# EAGLE board OpenDeck-r2.0.1 (EAGLE 7.4.0)
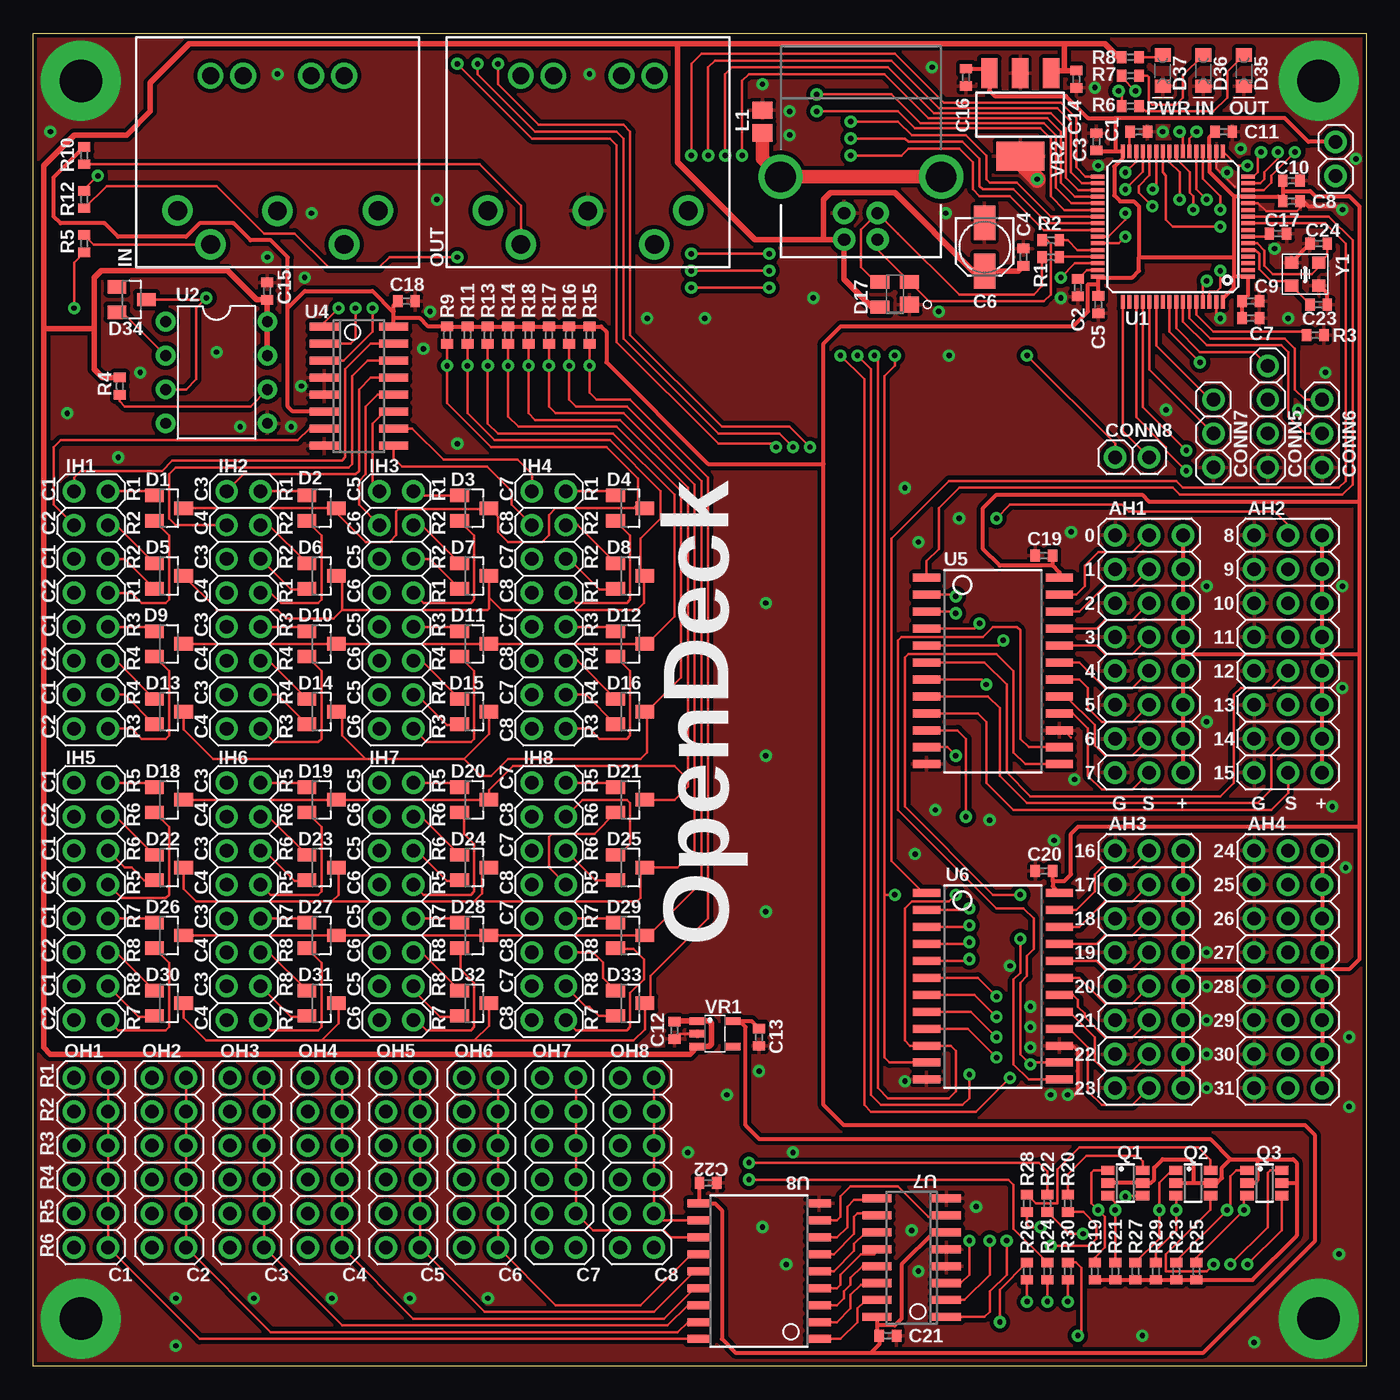
[diagram p5: board, top side]
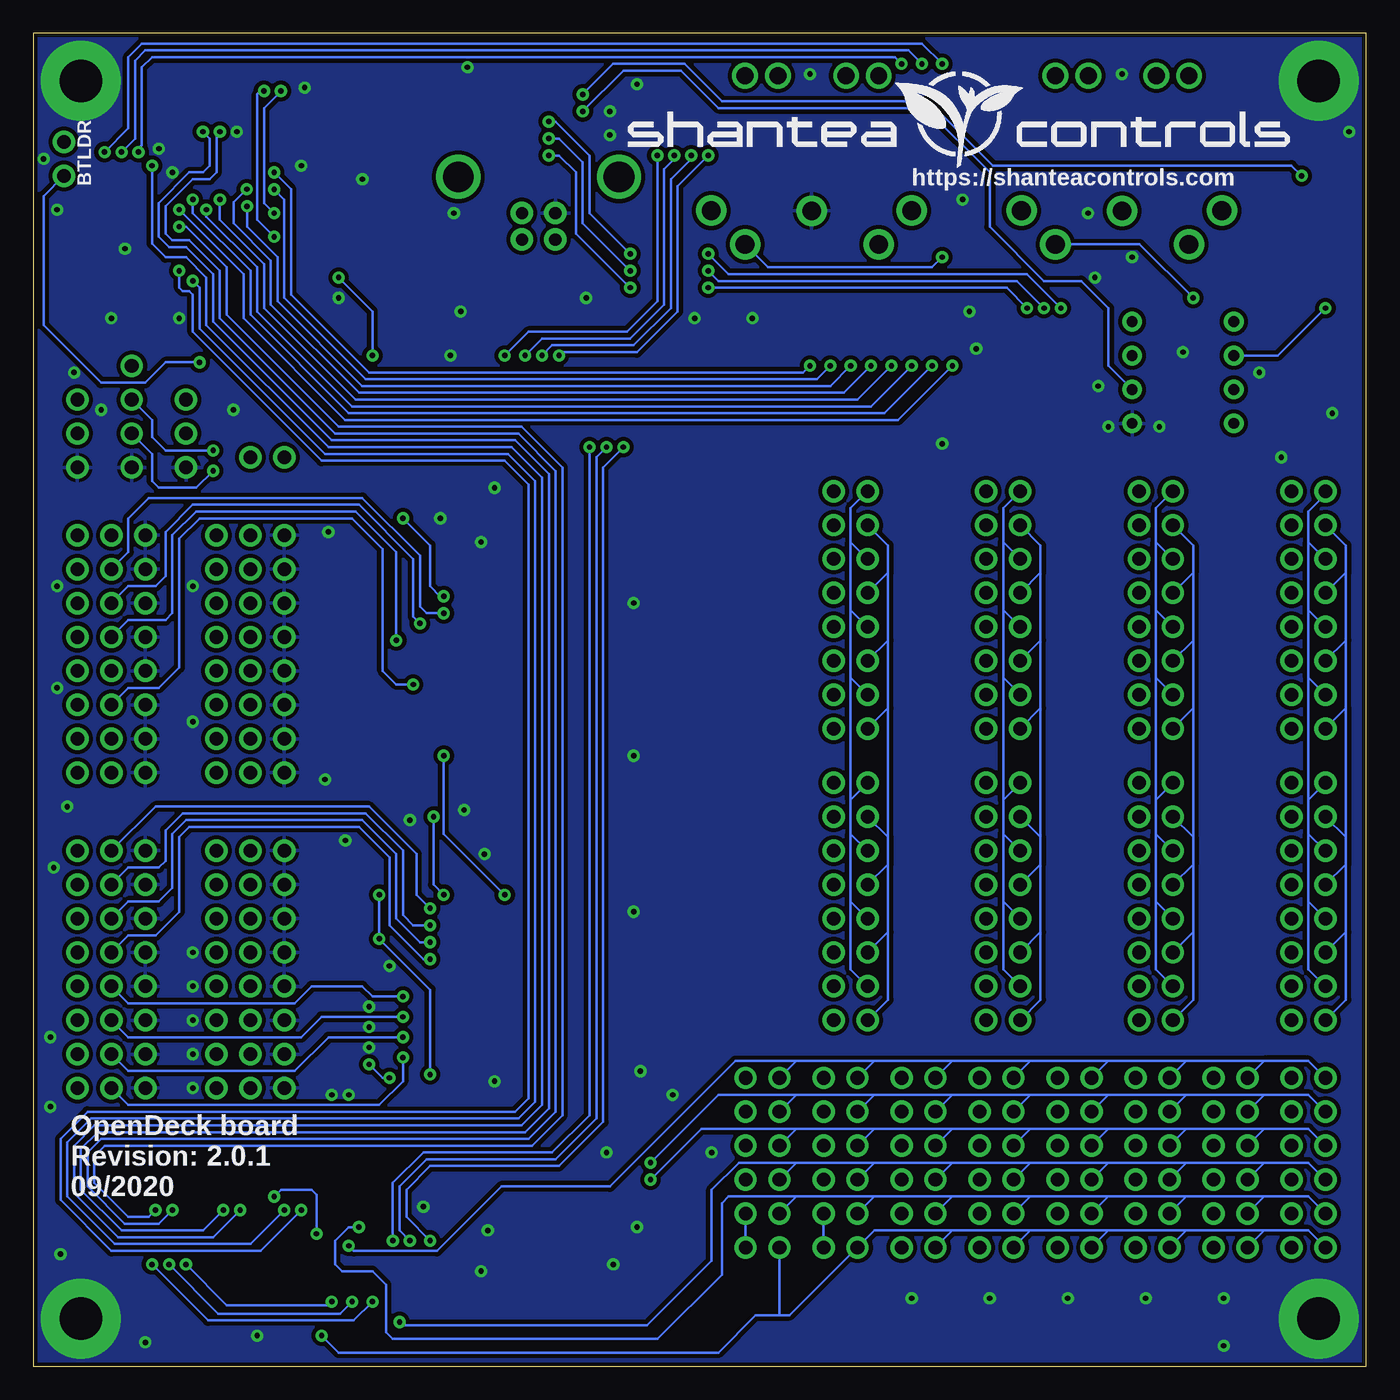
[diagram p6: board, bottom side, seen from below]

Size 99.82 x 99.82 mm. Coordinates in mm from the lower left corner, seen from the top.
Outline: 0,99.82 99.82,99.82 99.82,0 0,0 0,99.82
Copper layers (1*16): Top 0.035mm / dielectric 1.5mm / Bottom 0.035mm
Design rules "smiery *": minimum track width 8mil, minimum drill 12mil, track to track 7mil, track to pad 5mil, pad to pad 5mil, via to via 6mil, smd to smd 0mil, copper to edge 12mil, drill to drill 10mil, minimum pad ring 13mil, minimum via ring 10mil, stop-mask expansion 2mil, vias tented up to drill 25mil, thermal gap 10mil
Net classes: 0 default: width 0.203 mm; 1 vcc: width 0.254 mm

## Footprints (pad centres in the part's own frame; a part is rotated, then mirrored left to right if it is on the bottom)
3X08-2.54 = drill 1.016: 1 -8.89,-2.54; 2 -8.89,0; 3 -8.89,2.54; 4 -6.35,-2.54; 5 -6.35,0; 6 -6.35,2.54; 7 -3.81,-2.54; 8 -3.81,0; 9 -3.81,2.54; 10 -1.27,-2.54; 11 -1.27,0; 12 -1.27,2.54; 13 1.27,-2.54; 14 1.27,0; 15 1.27,2.54; 16 3.81,-2.54; 17 3.81,0; 18 3.81,2.54; 19 6.35,-2.54; 20 6.35,0; 21 6.35,2.54; 22 8.89,-2.54; 23 8.89,0; 24 8.89,2.54
C0402 = smd 0.7 x 0.9: 1 -0.65,0; 2 0.65,0
153CLV-0405 = smd 2.6 x 1.6: + 1.8,0; - -1.8,0
USB-B-PTH = drill 0.914 pad 1.676: D+ 1.25,-4.572; D- 1.25,-6.553; GND -1.25,-4.572; VBUS -1.25,-6.553 | drill 2.286: S1 -6.02,-1.854; S2 6.02,-1.854
1X02-2.54-V = drill 1.016: 1 -1.27,0; 2 1.27,0
DIN5_SUPPORT = drill 1.4 pad 2.286: 1 -7.483,-4.768; 2 -0.003,-4.778; 3 7.527,-4.768; 4 -5.013,-7.298; 5 4.987,-7.288 | drill 1.27: 6 4.987,5.341; 7 -5.02,5.341; 8 -2.582,5.341; 9 2.523,5.341
1X04-2.54 = drill 1.016: 1 -3.81,0; 2 -1.27,0; 3 1.27,0; 4 3.81,0
1X03-2.54-V = drill 1.016: 1 -2.54,0; 2 0,0; 3 2.54,0
SOT23 = smd 1.4 x 1: 1 -1.1,0.95; 2 -1.1,-0.95; 3 1.1,0
SOT143 = smd 1.44 x 1.2: 1 -1.1,0.75 | smd 1.44 x 1: 2 -1.1,-0.95; 3 1.1,-0.95; 4 1.1,0.95
0805_LED = smd 0.978 x 1.2: A -1.175,0; C 1.18,0
2X08-2.54 = drill 1.016: 1 -8.89,-1.27; 2 -8.89,1.27; 3 -6.35,-1.27; 4 -6.35,1.27; 5 -3.81,-1.27; 6 -3.81,1.27; 7 -1.27,-1.27; 8 -1.27,1.27; 9 1.27,-1.27; 10 1.27,1.27; 11 3.81,-1.27; 12 3.81,1.27; 13 6.35,-1.27; 14 6.35,1.27; 15 8.89,-1.27; 16 8.89,1.27
L0805 = smd 1.3 x 1.5: 1 -0.85,0; 2 0.85,0
2X06-2.54-V = drill 1.016: 1 -6.35,-1.27; 2 -6.35,1.27; 3 -3.81,-1.27; 4 -3.81,1.27; 5 -1.27,-1.27; 6 -1.27,1.27; 7 1.27,-1.27; 8 1.27,1.27; 9 3.81,-1.27; 10 3.81,1.27; 11 6.35,-1.27; 12 6.35,1.27
SSOT6 = smd 0.99 x 0.69: 1 -1.3,0.95; 2 -1.3,0; 3 -1.3,-0.95; 4 1.3,-0.95; 5 1.3,0; 6 1.3,0.95
R0402 = smd 0.7 x 0.9: 1 -0.65,0; 2 0.65,0
TQFP-64-10X10 = smd 1 x 0.3: 1 -5.625,3.75; 2 -5.625,3.25; 3 -5.625,2.75; 4 -5.625,2.25; 5 -5.625,1.75; 6 -5.625,1.25; 7 -5.625,0.75; 8 -5.625,0.25; 9 -5.625,-0.25; 10 -5.625,-0.75; 11 -5.625,-1.25; 12 -5.625,-1.75; 13 -5.625,-2.25; 14 -5.625,-2.75; 15 -5.625,-3.25; 16 -5.625,-3.75; 33 5.625,-3.75; 34 5.625,-3.25; 35 5.625,-2.75; 36 5.625,-2.25; 37 5.625,-1.75; 38 5.625,-1.25; 39 5.625,-0.75; 40 5.625,-0.25; 41 5.625,0.25; 42 5.625,0.75; 43 5.625,1.25; 44 5.625,1.75; 45 5.625,2.25; 46 5.625,2.75; 47 5.625,3.25; 48 5.625,3.75 | smd 0.3 x 1: 17 -3.75,-5.625; 18 -3.25,-5.625; 19 -2.75,-5.625; 20 -2.25,-5.625; 21 -1.75,-5.625; 22 -1.25,-5.625; 23 -0.75,-5.625; 24 -0.25,-5.625; 25 0.25,-5.625; 26 0.75,-5.625; 27 1.25,-5.625; 28 1.75,-5.625; 29 2.25,-5.625; 30 2.75,-5.625; 31 3.25,-5.625; 32 3.75,-5.625; 49 3.75,5.625; 50 3.25,5.625; 51 2.75,5.625; 52 2.25,5.625; 53 1.75,5.625; 54 1.25,5.625; 55 0.75,5.625; 56 0.25,5.625; 57 -0.25,5.625; 58 -0.75,5.625; 59 -1.25,5.625; 60 -1.75,5.625; 61 -2.25,5.625; 62 -2.75,5.625; 63 -3.25,5.625; 64 -3.75,5.625
DIL08 = drill 0.813: 1 -3.81,3.81; 2 -3.81,1.27; 3 -3.81,-1.27; 4 -3.81,-3.81; 5 3.81,-3.81; 6 3.81,-1.27; 7 3.81,1.27; 8 3.81,3.81
SO16 = smd 2.2 x 0.6: 1 -2.6,4.445; 2 -2.6,3.175; 3 -2.6,1.905; 4 -2.6,0.635; 5 -2.6,-0.635; 6 -2.6,-1.905; 7 -2.6,-3.175; 8 -2.6,-4.445; 9 2.6,-4.445; 10 2.6,-3.175; 11 2.6,-1.905; 12 2.6,-0.635; 13 2.6,0.635; 14 2.6,1.905; 15 2.6,3.175; 16 2.6,4.445
SO24-W = smd 2.032 x 0.6: 1 -4.975,6.985; 2 -4.975,5.715; 3 -4.975,4.445; 4 -4.975,3.175; 5 -4.975,1.905; 6 -4.975,0.635; 7 -4.975,-0.635; 8 -4.975,-1.905; 9 -4.975,-3.175; 10 -4.975,-4.445; 11 -4.975,-5.715; 12 -4.975,-6.985; 13 4.975,-6.985; 14 4.975,-5.715; 15 4.975,-4.445; 16 4.975,-3.175; 17 4.975,-1.905; 18 4.975,-0.635; 19 4.975,0.635; 20 4.975,1.905; 21 4.975,3.175; 22 4.975,4.445; 23 4.975,5.715; 24 4.975,6.985
SO18 = smd 1.8 x 0.6: 1 -4.475,5.08; 2 -4.475,3.81; 3 -4.475,2.54; 4 -4.475,1.27; 5 -4.475,0; 6 -4.475,-1.27; 7 -4.475,-2.54; 8 -4.475,-3.81; 9 -4.475,-5.08; 10 4.475,-5.08; 11 4.475,-3.81; 12 4.475,-2.54; 13 4.475,-1.27; 14 4.475,0; 15 4.475,1.27; 16 4.475,2.54; 17 4.475,3.81; 18 4.475,5.08
SOT23-5 = smd 1.2 x 0.55: 1 1.3,-0.95; 2 1.3,0; 3 1.3,0.95; 4 -1.3,0.95; 5 -1.3,-0.95
SOT223 = smd 2.235 x 1.219: 1 -3.099,2.311; 2 -3.099,0; 3 -3.099,-2.311 | smd 2.2 x 3.6: 4 3.099,0
CRYSTAL-SMD-2.5X2 = smd 1 x 0.9: 1 -1.025,-0.875; 2 1.025,-0.875; 3 1.025,0.875; 4 -1.025,0.875

## Placement (x,y rotation side)
AH1  PINHD-3X08  [3X08-2.54]  83.57,53.34 270 top
AH2  PINHD-3X08  [3X08-2.54]  93.98,53.34 270 top
AH3  PINHD-3X08  [3X08-2.54]  83.57,29.72 270 top
AH4  PINHD-3X08  [3X08-2.54]  93.98,29.72 270 top
C1  2.2u  [C0402]  82.8,92.46 180 top
C2  2.2u  [C0402]  78.23,80.77 270 top
C3  100n  [C0402]  79.63,91.69 90 top
C4  100n  [C0402]  74.17,83.06 270 top
C5  100n  [C0402]  79.76,79.5 270 top
C6  10u  [153CLV-0405]  71.25,83.82 270 top
C7  100n  [C0402]  91.19,78.49 0 top
C8  100n  [C0402]  94.23,87.25 0 top
C9  100n  [C0402]  91.19,79.76 0 top
C10  100n  [C0402]  94.23,88.77 0 top
C11  100n  [C0402]  89.15,92.46 0 top
C12  4.7u  [C0402]  48.01,25.15 270 top
C13  4.7u  [C0402]  54.36,24.64 270 top
C14  4.7u  [C0402]  78.11,96.39 270 top
C15  100n  [C0402]  17.53,80.52 270 top
C16  4.7u  [C0402]  69.85,96.52 270 top
C17  100n  [C0402]  93.22,84.84 0 top
C18  100n  [C0402]  27.94,79.76 180 top
C19  100n  [C0402]  75.69,60.71 0 top
C20  100n  [C0402]  75.69,37.08 0 top
C21  100n  [C0402]  64.01,2.29 0 top
C22  100n  [C0402]  50.55,13.72 0 top
C23  18p  [C0402]  96.27,79.5 0 top
C24  18p  [C0402]  96.27,84.07 180 top
CONN1  USB-H  [USB-B-PTH]  61.98,90.93 0 top
CONN2  PINHD-1X02-TH-2.54MM  [1X02-2.54-V]  97.54,90.42 90 top
CONN3  MIDI_CONN-STD  [DIN5_SUPPORT]  18.29,91.31 0 top
CONN4  MIDI_CONN-STD  [DIN5_SUPPORT]  41.53,91.31 0 top
CONN5  PINHD-1X04-TH-2.54MM  [1X04-2.54]  92.46,71.12 270 top
CONN6  PINHD-1X03-TH-2.54MM  [1X03-2.54-V]  96.52,69.85 270 top
CONN7  PINHD-1X03-TH-2.54MM  [1X03-2.54-V]  88.39,69.85 270 top
CONN8  PINHD-1X02-TH-2.54MM  [1X02-2.54-V]  82.3,68.07 0 top
D1  BAW56  [SOT23]  10.16,64.26 0 top
D2  BAW56  [SOT23]  21.59,64.26 0 top
D3  BAW56  [SOT23]  33.02,64.26 0 top
D4  BAW56  [SOT23]  44.7,64.26 0 top
D5  BAW56  [SOT23]  10.16,59.18 0 top
D6  BAW56  [SOT23]  21.59,59.18 0 top
D7  BAW56  [SOT23]  33.02,59.18 0 top
D8  BAW56  [SOT23]  44.7,59.18 0 top
D9  BAW56  [SOT23]  10.16,54.1 0 top
D10  BAW56  [SOT23]  21.59,54.1 0 top
D11  BAW56  [SOT23]  33.02,54.1 0 top
D12  BAW56  [SOT23]  44.7,54.1 0 top
D13  BAW56  [SOT23]  10.16,49.02 0 top
D14  BAW56  [SOT23]  21.59,49.02 0 top
D15  BAW56  [SOT23]  33.02,49.02 0 top
D16  BAW56  [SOT23]  44.7,49.02 0 top
D17  PRTR5V0U2X  [SOT143]  64.52,80.26 180 top
D18  BAW56  [SOT23]  10.16,42.42 0 top
D19  BAW56  [SOT23]  21.59,42.42 0 top
D20  BAW56  [SOT23]  33.02,42.42 0 top
D21  BAW56  [SOT23]  44.7,42.42 0 top
D22  BAW56  [SOT23]  10.16,37.34 0 top
D23  BAW56  [SOT23]  21.59,37.34 0 top
D24  BAW56  [SOT23]  33.02,37.34 0 top
D25  BAW56  [SOT23]  44.7,37.34 0 top
D26  BAW56  [SOT23]  10.16,32.26 0 top
D27  BAW56  [SOT23]  21.59,32.26 0 top
D28  BAW56  [SOT23]  33.02,32.26 0 top
D29  BAW56  [SOT23]  44.7,32.26 0 top
D30  BAW56  [SOT23]  10.16,27.18 0 top
D31  BAW56  [SOT23]  21.59,27.18 0 top
D32  BAW56  [SOT23]  33.02,27.18 0 top
D33  BAW56  [SOT23]  44.7,27.18 0 top
D34  BAW56  [SOT23]  7.37,79.88 0 top
D35  Red  [0805_LED]  90.68,97.03 270 top
D36  Yellow  [0805_LED]  87.63,97.03 270 top
D37  Green  [0805_LED]  84.58,97.03 270 top
IH1  PINHD-2X08-TH-2.54MM  [2X08-2.54]  4.32,56.64 270 top
IH2  PINHD-2X08-TH-2.54MM  [2X08-2.54]  15.75,56.64 270 top
IH3  PINHD-2X08-TH-2.54MM  [2X08-2.54]  27.18,56.64 270 top
IH4  PINHD-2X08-TH-2.54MM  [2X08-2.54]  38.61,56.64 270 top
IH5  PINHD-2X08-TH-2.54MM  [2X08-2.54]  4.32,34.8 270 top
IH6  PINHD-2X08-TH-2.54MM  [2X08-2.54]  15.75,34.8 270 top
IH7  PINHD-2X08-TH-2.54MM  [2X08-2.54]  27.18,34.8 270 top
IH8  PINHD-2X08-TH-2.54MM  [2X08-2.54]  38.61,34.8 270 top
L1  FERRITE_BEAD-BLM21PG221SN1D  [L0805]  54.61,93.22 270 top
OH1  PINHD-2X06-TH-2.54MM  [2X06-2.54-V]  4.32,15.24 270 top
OH2  PINHD-2X06-TH-2.54MM  [2X06-2.54-V]  10.16,15.24 270 top
OH3  PINHD-2X06-TH-2.54MM  [2X06-2.54-V]  16,15.24 270 top
OH4  PINHD-2X06-TH-2.54MM  [2X06-2.54-V]  21.84,15.24 270 top
OH5  PINHD-2X06-TH-2.54MM  [2X06-2.54-V]  27.69,15.24 270 top
OH6  PINHD-2X06-TH-2.54MM  [2X06-2.54-V]  33.53,15.24 270 top
OH7  PINHD-2X06-TH-2.54MM  [2X06-2.54-V]  39.37,15.24 270 top
OH8  PINHD-2X06-TH-2.54MM  [2X06-2.54-V]  45.21,15.24 270 top
Q1  FDC6312P  [SSOT6]  81.79,13.72 0 top
Q2  FDC6312P  [SSOT6]  86.87,13.72 0 top
Q3  FDC6312P  [SSOT6]  92.2,13.72 0 top
R1  22  [R0402]  76.2,83.06 0 top
R2  22  [R0402]  76.2,84.33 180 top
R3  510  [R0402]  96.01,77.22 180 top
R4  10k  [R0402]  6.48,73.41 270 top
R5  220  [R0402]  3.81,84.07 270 top
R6  1k  [R0402]  82.17,94.36 180 top
R7  1k  [R0402]  82.17,96.65 180 top
R8  1k  [R0402]  82.17,98.04 0 top
R9  4.7k  [R0402]  30.99,77.22 270 top
R10  33  [R0402]  3.81,90.68 90 top
R11  4.7k  [R0402]  32.51,77.22 270 top
R12  10  [R0402]  3.81,87.38 90 top
R13  4.7k  [R0402]  34.04,77.22 270 top
R14  4.7k  [R0402]  35.56,77.22 270 top
R15  4.7k  [R0402]  41.66,77.22 270 top
R16  4.7k  [R0402]  40.13,77.22 270 top
R17  4.7k  [R0402]  38.61,77.22 270 top
R18  4.7k  [R0402]  37.08,77.22 270 top
R19  4.7k  [R0402]  79.5,7.11 90 top
R20  36  [R0402]  77.47,12.19 90 top
R21  4.7k  [R0402]  81.03,7.11 90 top
R22  36  [R0402]  75.95,12.19 90 top
R23  4.7k  [R0402]  85.6,7.11 90 top
R24  36  [R0402]  75.95,7.11 270 top
R25  4.7k  [R0402]  87.12,7.11 90 top
R26  36  [R0402]  74.42,7.11 270 top
R27  4.7k  [R0402]  82.55,7.11 90 top
R28  36  [R0402]  74.42,12.19 90 top
R29  4.7k  [R0402]  84.07,7.11 90 top
R30  36  [R0402]  77.47,7.11 270 top
U1  STM32F405RGT6  [TQFP-64-10X10]  85.34,85.34 180 top
U2  6N137  [DIL08]  13.72,74.42 0 top
U4  74HC138-SO  [SO16]  24.38,73.41 0 top
U5  MC14067BDWR2G-SO24W  [SO24-W]  71.88,52.07 0 top
U6  MC14067BDWR2G-SO24W  [SO24-W]  71.88,28.45 0 top
U7  74HC238-SO  [SO16]  65.79,8.13 180 top
U8  ULN2803A-SO  [SO18]  54.36,7.11 180 top
VR1  LP5907-4.5V  [SOT23-5]  51.05,24.89 180 top
VR2  MCP1825  [SOT223]  73.91,93.73 270 top
Y1  16MHz  [CRYSTAL-SMD-2.5X2]  95.25,81.79 0 top

## Tracks (layer width: path | path; a pad name or v marks a point on that pad's centre or on a via)
+3V3
  Top 0.305: 81.03,90.97 U1.32 81.59,90.48 80.96,89.85 80.96,87.69 81.41,87.25 82.42,87.25 82.8,86.87 82.8,83.06 | 81.03,90.97 79.7,90.97 C3.1 | 79.72,81.03 U1.48 79.78,81.53 82.3,81.53 82.8,82.04 82.8,83.06 | 79.72,81.03 79.72,80.19 C5.1 | C11.1 88.09,92.05 U1.19 88.09,89.45 89.92,87.63 | C10.1 93.58,88.01 | 93.58,88.01 C8.1 93.24,87.59 U1.13 89.95,87.59 89.92,87.63 | 89.92,87.63 89.92,83.06 | 89.92,83.06 89.92,81.53 | 89.92,81.53 89.98,81.59 U1.1 90.97,80.19 C9.1 C7.1 | C16.1 71.26,97.17 VR2.3 71.6,95.53 72.01,95.12 77.34,95.12 78.99,93.47 81.03,93.47 | 81.03,93.47 81.03,90.97 | U4.16 26.98,78.49 | 26.98,78.49 26.98,78.99 | 26.98,78.99 26.98,79.45 C18.2 | 26.98,78.49 28.96,78.49 29.58,77.87 R9.1 R11.1 R13.1 R14.1 R18.1 R17.1 R16.1 R15.1 42.53,77.87 42.93,77.47 42.93,75.18 50.55,67.56 59.18,67.56 | U4.6 19.43,71.5 19.05,71.88 19.05,79.25 | 19.05,79.25 20.32,80.52 25.4,80.52 26.92,78.99 26.98,78.99 | 79.72,81.03 78.99,81.03 78.99,78.99 77.87,77.87 60.45,77.87 59.18,76.6 59.18,67.56 | U7.16 63.19,3.05 | 63.19,3.05 63.19,2.46 C21.1 63.36,1.64 62.74,1.02 | U7.6 67.44,10.03 65.02,7.62 65.02,3.56 64.52,3.05 63.19,3.05 | 62.74,1.02 52.58,1.02 51.56,2.03 51.56,11.68 51.05,12.19 U8.10 49.88,13.7 C22.1 | 76.36,59.94 76.36,60.69 C19.2 | 76.36,36.32 76.36,37.07 C20.2 | 76.36,59.94 72.39,59.94 71.12,61.21 71.12,64.26 72.14,65.28 83.06,65.28 83.57,64.77 99.31,64.77 | 76.36,36.32 77.22,36.32 77.72,36.83 77.72,39.88 78.23,40.39 99.31,40.39 | 62.74,1.02 87.63,1.02 96.01,9.4 96.01,17.27 95.25,18.03 60.71,18.03 59.18,19.56 59.18,67.56 | 81.03,93.47 93.73,93.47 95.5,91.69 CONN2.2 | 82.8,83.06 89.92,83.06
  Top 0.305: U1.64 89.09,79.95 89.92,80.77 89.92,81.53 | 93.58,88.01 95.63,88.01 96.01,87.63 98.55,87.63 99.31,86.87 99.31,64.77 | AH1.3 AH1.6 AH1.9 AH1.12 86.11,53.34 | 86.11,53.34 AH1.15 AH1.18 AH1.21 AH1.24 | AH2.24 AH2.21 AH2.18 AH2.15 96.52,53.34 | AH2.3 AH2.6 AH2.9 AH2.12 96.52,53.34 | 99.31,64.77 99.31,53.34 | AH3.3 AH3.6 AH3.9 AH3.12 86.11,29.72 | AH3.24 AH3.21 AH3.18 AH3.15 86.11,29.72 | AH4.3 AH4.6 AH4.9 AH4.12 96.52,29.72 | 96.52,29.72 AH4.15 AH4.18 AH4.21 AH4.24 | 86.11,53.34 96.52,53.34 | 96.52,53.34 99.31,53.34 | 99.31,53.34 99.31,40.39 | 99.31,40.39 99.31,30.48 98.55,29.72 96.52,29.72 | 86.11,29.72 96.52,29.72 | 19.05,79.25 19.05,83.06 17.78,84.33 16.26,84.33 14.99,85.6 12.45,85.6 11.43,84.58 6.35,84.58 5.33,85.6 2.03,85.6 1.52,86.11 1.52,89.04 R10.2 | U5.24 76.86,59.44 76.36,59.94 | 76.36,36.32 76.36,35.93 U6.24
+5V
  Top 0.406: R8.1 81.28,98.04 80.26,99.06 77.22,99.06 | 77.22,99.06 48.26,99.06 | 4.57,77.72 4.57,74.68 5.19,74.06 R4.1 | 4.57,77.72 4.57,81.53 5.08,82.04 14.57,82.04 16.74,79.87 C15.2 U2.8 U2.7 | 4.57,77.72 0.76,77.72 | D17.4 62.81,79.31 60.73,81.4 CONN1.VBUS 59.18,84.38 | C14.1 77.22,97.04 | 77.22,97.04 76.44,97.04 VR2.1 | 77.22,97.04 77.22,99.06 | C4.2 73.78,82.02 C6.+ 70.38,82.02 64.52,87.88 59.69,87.88 59.18,87.38 59.18,84.38 | 48.26,99.06 48.26,90.17 54.05,84.38 59.18,84.38 | 48.26,99.06 11.68,99.06 8.76,96.14 8.76,93.98 6.99,92.2 3.05,92.2 0.76,89.92 0.76,77.72 | VR1.3 50.61,23.94 50.8,24.13 50.8,25.65 50.61,25.84 VR1.1 48.05,25.84 C12.1 | 0.76,77.72 0.76,23.88 1.27,23.37 49.18,23.37 VR1.3 | 49.78,23.91 VR1.3
A_IN_0
  Top 0.203: U5.23 78.11,57.78 78.74,58.42 78.74,59.94 79.76,60.96 82.3,60.96 AH1.2
A_IN_1
  Top 0.203: U5.22 78.36,56.52 80.26,58.42 82.3,58.42 AH1.5
A_IN_2
  Top 0.203: U5.21 79.63,55.24 80.26,55.88 82.3,55.88 AH1.8
A_IN_3
  Top 0.203: U5.20 79.63,53.98 80.26,53.34 82.3,53.34 AH1.11
A_IN_4
  Top 0.203: U5.19 78.36,52.7 80.26,50.8 82.3,50.8 AH1.14
A_IN_5
  Top 0.203: U5.18 78.36,51.44 78.99,50.8 78.99,49.28 80.01,48.26 82.3,48.26 AH1.17
A_IN_6
  Top 0.203: U5.17 77.34,50.16 79.5,48.01 79.5,46.48 80.26,45.72 82.3,45.72 AH1.20
A_IN_7
  Top 0.203: U5.16 77.85,48.9 78.99,47.75 78.99,44.2 80.01,43.18 82.3,43.18 AH1.23
A_IN_8  (via drill 0.4 pad 0.6)
  Top 0.203: v72.14,63.5 73.15,64.52 81.53,64.52 82.04,64.01 92.96,64.01 93.98,62.99 AH2.2 | U5.2 68.96,57.78 v69.09,57.66
  Bottom 0.203: v72.14,63.5 70.1,61.47 70.1,58.42 69.34,57.66 v69.09,57.66
A_IN_9  (via drill 0.4 pad 0.6)
  Top 0.203: U5.3 68.96,56.52 v69.09,56.39
  Bottom 0.203: v69.09,56.39 70.36,56.39 70.87,56.9 70.87,60.71 75.18,65.02 91.19,65.02 92.71,63.5 92.71,60.96 AH2.5
A_IN_10  (via drill 0.4)
  Top 0.203: U5.4 70.48,55.24 v70.87,55.63
  Bottom 0.203: v70.87,55.63 71.37,56.13 71.37,60.45 75.44,64.52 87.88,64.52 89.92,62.48 89.92,59.18 90.68,58.42 92.71,58.42 AH2.8
A_IN_11  (via drill 0.4)
  Top 0.203: v72.64,54.36 72.26,53.98 U5.5
  Bottom 0.203: v72.64,54.36 72.64,60.96 75.69,64.01 87.63,64.01 89.41,62.23 89.41,56.39 89.92,55.88 92.71,55.88 AH2.11
A_IN_12
  Top 0.203: U5.6 71.25,52.7 72.9,51.05 72.9,44.45 74.68,42.67 88.9,42.67 89.92,43.69 89.92,50.29 90.42,50.8 92.71,50.8 AH2.14
A_IN_13  (via drill 0.4)
  Top 0.203: U5.7 70.99,51.44 v71.37,51.05
  Bottom 0.203: v71.37,51.05 72.64,51.05 73.66,52.07 73.66,61.21 75.95,63.5 87.38,63.5 88.9,61.98 88.9,52.32 90.42,50.8 92.71,50.8 AH2.17
A_IN_14
  Top 0.203: U5.8 71.5,50.16 72.39,49.28 72.39,44.2 74.42,42.16 91.69,42.16 92.71,43.18 92.71,45.72 AH2.20
A_IN_15
  Top 0.203: U5.9 70.74,48.9 71.37,48.26 71.37,43.69 73.41,41.66 92.71,41.66 93.98,42.93 AH2.23
A_IN_16
  Top 0.203: U6.23 78.11,34.16 79.5,35.56 79.5,36.83 80.01,37.34 82.3,37.34 AH3.2
A_IN_17
  Top 0.203: U6.22 78.36,32.89 80.26,34.8 82.3,34.8 AH3.5
A_IN_18
  Top 0.203: U6.21 79.63,31.62 80.26,32.26 82.3,32.26 AH3.8
A_IN_19
  Top 0.203: U6.20 79.63,30.35 80.26,29.72 82.3,29.72 AH3.11
A_IN_20
  Top 0.203: U6.19 78.36,29.08 80.26,27.18 82.3,27.18 AH3.14
A_IN_21
  Top 0.203: U6.18 77.85,27.81 78.23,27.43 78.23,26.92 78.74,26.42 78.74,26.16 80.26,24.64 82.3,24.64 AH3.17
A_IN_22
  Top 0.203: U6.17 77.6,26.54 79.5,24.64 79.5,22.86 80.26,22.1 82.3,22.1 AH3.20
A_IN_23
  Top 0.203: 77.09,25.27 U6.16 77.6,25.27 78.99,23.88 78.99,20.57 80.01,19.56 82.3,19.56 AH3.23
A_IN_24  (via drill 0.4)
  Top 0.203: U6.2 69.98,34.16 v70.1,34.29
  Bottom 0.203: v70.1,34.29 71.12,35.31 71.12,38.35 74.68,41.91 90.68,41.91 AH4.2
A_IN_25  (via drill 0.4)
  Top 0.203: U6.3 69.98,32.89 v70.1,33.02
  Bottom 0.203: v70.1,33.02 71.37,33.02 72.14,33.78 72.14,38.61 74.93,41.4 88.65,41.4 89.92,40.13 89.92,37.85 90.42,37.34 92.71,37.34 AH4.5
A_IN_26  (via drill 0.4)
  Top 0.203: U6.4 69.98,31.62 v70.1,31.75
  Bottom 0.203: v70.1,31.75 70.87,31.75 72.64,33.53 72.64,38.35 75.18,40.89 88.39,40.89 89.41,39.88 89.41,35.81 90.42,34.8 92.71,34.8 AH4.8
A_IN_27  (via drill 0.4)
  Top 0.203: U6.5 69.98,30.35 v70.1,30.48
  Bottom 0.203: v70.1,30.48 70.61,30.48 73.15,33.02 73.15,38.1 75.44,40.39 88.14,40.39 88.9,39.62 88.9,34.04 90.68,32.26 92.71,32.26 AH4.11
A_IN_28  (via drill 0.4)
  Top 0.203: U6.6 70.74,29.08 v72.14,27.69
  Bottom 0.203: v72.14,27.69 74.42,27.69 75.18,28.45 78.99,28.45 80.26,27.18 92.71,27.18 AH4.14
A_IN_29  (via drill 0.4)
  Top 0.203: U6.7 70.48,27.81 v72.14,26.16
  Bottom 0.203: v72.14,26.16 78.23,26.16 79.76,24.64 92.71,24.64 AH4.17
A_IN_30  (via drill 0.4)
  Top 0.203: U6.8 70.23,26.54 v72.14,24.64
  Bottom 0.203: v72.14,24.64 77.72,24.64 80.26,22.1 92.71,22.1 AH4.20
A_IN_31  (via drill 0.4)
  Top 0.203: U6.9 69.98,25.27 v72.14,23.11
  Bottom 0.203: v72.14,23.11 72.14,21.34 73.91,19.56 92.71,19.56 AH4.23
BC_1
  Top 0.203: IH1.1 3.05,66.55 3.56,67.06 9.65,67.06 10.41,67.82 23.11,67.82 23.37,68.07 23.37,74.68 25.27,76.58 U4.15
  Bottom 0.203: IH5.1 4.32,42.42 | 4.32,42.42 4.32,39.88 | 4.32,39.88 IH5.5 | IH5.9 4.32,34.8 | 4.32,34.8 4.32,39.88 | IH5.13 4.32,29.72 4.32,34.8 | IH1.1 3.05,65.28 4.32,64.01 4.32,61.72 | 4.32,61.72 IH1.5 | IH1.9 4.32,56.64 | 4.32,56.64 4.32,61.72 | 4.32,51.56 4.32,56.64 | IH1.13 4.32,51.56 | 4.32,51.56 4.32,42.42
BC_2
  Top 0.203: IH1.3 1.52,64.52 1.52,68.83 2.03,69.34 19.81,69.34 20.7,70.23 U4.7
  Bottom 0.203: IH1.3 1.52,61.47 1.52,59.44 | 1.52,59.44 IH1.7 | IH1.11 1.52,54.36 | 1.52,54.36 1.52,59.44 | 1.52,49.28 1.52,54.36 | IH5.3 1.52,39.62 | 1.52,39.62 1.52,37.59 | 1.52,37.59 IH5.7 | IH5.11 1.52,32.51 | 1.52,32.51 1.52,37.59 | IH5.15 1.52,27.43 1.52,32.51 | IH1.15 1.52,49.28 | 1.52,49.28 1.52,39.62
BC_3
  Top 0.203: IH2.1 15.75,66.8 24.13,66.8 24.38,67.06 24.38,73.15 25.27,74.04 U4.13
  Bottom 0.203: IH6.1 15.75,42.42 | 15.75,42.42 15.75,39.88 | 15.75,39.88 IH6.5 | IH6.9 15.75,34.8 | 15.75,34.8 15.75,39.88 | IH6.13 15.75,29.72 15.75,34.8 | IH2.1 15.75,64.26 15.75,61.72 | 15.75,61.72 IH2.5 | IH2.9 15.75,56.64 | 15.75,56.64 15.75,61.72 | 15.75,51.56 15.75,56.64 | IH2.13 15.75,51.56 | 15.75,51.56 15.75,42.42
BC_4
  Top 0.203: IH2.3 10.67,62.99 10.16,63.5 10.16,66.8 10.67,67.31 23.62,67.31 23.88,67.56 23.88,74.17 25.02,75.31 U4.14
  Bottom 0.203: IH2.3 12.95,61.47 12.95,59.44 | 12.95,59.44 IH2.7 | IH2.11 12.95,54.36 | 12.95,54.36 12.95,59.44 | IH2.15 12.95,49.28 | 12.95,49.28 12.95,54.36 | 12.95,39.62 12.95,37.59 | 12.95,37.59 IH6.7 | IH6.11 12.95,32.51 | 12.95,32.51 12.95,37.59 | IH6.15 12.95,27.43 12.95,32.51 | IH6.3 12.95,39.62 | 12.95,39.62 12.95,49.28
BC_5
  Top 0.203: IH3.1 25.4,66.04 25.4,70.61 26.29,71.5 U4.11
  Bottom 0.203: IH3.1 27.18,64.26 27.18,61.72 | 27.18,61.72 IH3.5 | IH3.9 27.18,56.64 | 27.18,56.64 27.18,61.72 | IH3.13 27.18,51.56 | 27.18,51.56 27.18,56.64 | 27.18,42.42 27.18,39.88 | 27.18,39.88 IH7.5 | IH7.9 27.18,34.8 | 27.18,34.8 27.18,39.88 | IH7.13 27.18,29.72 27.18,34.8 | IH7.1 27.18,42.42 | 27.18,42.42 27.18,51.56
BC_6
  Top 0.203: IH3.3 24.38,64.52 24.38,66.29 24.89,66.8 24.89,71.88 25.78,72.77 U4.12
  Bottom 0.203: 24.38,39.62 24.38,37.59 | 24.38,37.59 IH7.7 | IH7.11 24.38,32.51 | 24.38,32.51 24.38,37.59 | IH7.15 24.38,27.43 24.38,32.51 | IH3.3 24.38,61.47 24.38,59.44 | 24.38,59.44 IH3.7 | IH3.11 24.38,54.36 | 24.38,54.36 24.38,59.44 | IH3.15 24.38,49.28 | 24.38,49.28 24.38,54.36 | IH7.3 24.38,39.62 | 24.38,39.62 24.38,49.28
BC_7
  Top 0.203: IH4.1 37.34,66.8 36.26,67.88 30.73,67.88 28.38,70.23 U4.10
  Bottom 0.203: 38.61,42.42 38.61,39.88 | 38.61,39.88 IH8.5 | IH8.9 38.61,34.8 | 38.61,34.8 38.61,39.88 | IH8.13 38.61,29.72 38.61,34.8 | IH4.1 38.61,64.26 38.61,61.72 | 38.61,61.72 IH4.5 | IH4.9 38.61,56.64 | 38.61,56.64 38.61,61.72 | IH4.13 38.61,51.56 | 38.61,51.56 38.61,56.64 | IH8.1 38.61,42.42 | 38.61,42.42 38.61,51.56
BC_8
  Top 0.203: IH4.3 35.81,64.52 35.81,65.53 33.97,67.37 27.62,67.37 26.98,68.01 U4.9
  Bottom 0.203: 35.81,39.62 35.81,37.59 | 35.81,37.59 IH8.7 | IH8.11 35.81,32.51 | 35.81,32.51 35.81,37.59 | IH8.15 35.81,27.43 35.81,32.51 | IH4.3 35.81,61.47 35.81,59.44 | 35.81,59.44 IH4.7 | IH4.11 35.81,54.36 | 35.81,54.36 35.81,59.44 | IH4.15 35.81,49.28 | 35.81,49.28 35.81,54.36 | IH8.3 35.81,39.62 | 35.81,39.62 35.81,49.28
BOOT0
  Top 0.203: U1.60 87.09,78.77 88.39,77.47 95.11,77.47 R3.2
BR_1  (via drill 0.4)
  Top 0.203: 44.96,64.26 39.12,64.26 38.61,63.75 38.61,62.23 38.1,61.72 35.56,61.72 34.8,62.48 34.8,63.58 D3.3 34.04,64.18 27.35,64.18 27.18,64.01 27.18,62.23 26.67,61.72 24.89,61.72 22.69,63.92 D2.3 D1.3 | 44.96,64.26 D4.3 | 44.96,64.26 45.3,64.6 45.3,66.46 42.93,68.83 34.29,68.83 30.99,72.14 v30.99,74.93 R9.2 | U1.20 87.59,88.94 88.9,87.63 v88.9,86.61
  Bottom 0.203: v30.99,74.93 35.05,70.87 76.45,70.87 84.07,78.49 84.07,81.79 v88.9,86.61
BR_2  (via drill 0.4)
  Top 0.203: D6.3 22.78,59.18 23.11,58.84 23.11,56.64 | 23.11,56.64 22.48,56.01 18.92,56.01 18.29,56.64 13.72,56.64 13.72,56.73 D5.3 | 23.11,56.64 34.04,56.64 34.12,56.73 D7.3 34.12,57.57 35.05,56.64 45.21,56.64 45.72,57.15 45.72,59.18 D8.3 45.47,59.52 45.47,61.98 46.99,63.5 46.99,65.53 43.18,69.34 34.54,69.34 32.51,71.37 v32.51,74.93 R11.2 | U1.21 87.09,88.17 v87.88,87.38
  Bottom 0.203: v32.51,74.93 36.07,71.37 76.2,71.37 83.57,78.74 83.57,82.04 87.88,86.36 v87.88,87.38
BR_3  (via drill 0.4)
  Top 0.203: D9.3 D10.3 D11.3 D12.3 45.97,54.1 48.01,56.13 48.01,65.28 43.43,69.85 34.8,69.85 34.04,70.61 v34.04,74.93 R13.2 | v86.87,86.61 86.87,87.63 86.61,87.88 86.61,89.41 85.59,90.43 U1.24
  Bottom 0.203: v34.04,74.93 37.08,71.88 75.95,71.88 83.06,78.99 83.06,82.3 86.87,86.11 v86.87,86.61
BR_4  (via drill 0.4)
  Top 0.203: 45.97,49.02 48.51,51.56 48.51,65.53 43.69,70.36 36.32,70.36 35.56,71.12 v35.56,74.93 R14.2 | D15.3 34.12,47.33 32.26,45.47 | 32.26,45.47 24.89,45.47 | 24.89,45.47 23.11,47.24 23.11,48.6 D14.3 | D13.3 11.26,47.67 13.46,45.47 24.89,45.47 | 45.97,49.02 45.97,45.97 45.47,45.47 35.56,45.47 34.29,44.2 33.53,44.2 32.26,45.47 | D16.3 45.97,49.02 | v85.85,87.38 85.85,89.41 85.09,90.17 U1.25
  Bottom 0.203: v35.56,74.93 38.1,72.39 75.69,72.39 82.55,79.25 82.55,82.55 85.85,85.85 v85.85,87.38
BR_5  (via drill 0.4)
  Top 0.203: D30.3 11.26,26.08 12.95,24.38 21.59,24.38 | 21.59,24.38 22.86,25.65 22.86,27.01 D31.3 | D32.3 34.12,25.48 33.02,24.38 | 33.02,24.38 21.59,24.38 | 33.02,24.38 44.96,24.38 45.8,25.23 D33.3 46.23,27.6 46.23,29.21 50.55,33.53 50.55,66.55 44.7,72.39 42.16,72.39 41.66,72.9 v41.66,74.93 R15.2 | v81.79,89.41 82.59,90.21 U1.30
  Bottom 0.203: v41.66,74.93 42.16,74.42 74.68,74.42 80.52,80.26 80.52,88.14 v81.79,89.41
BR_6  (via drill 0.4)
  Top 0.203: D26.3 D27.3 D28.3 | D28.3 34.12,31.92 | D28.3 D29.3 46.06,32.26 50.04,36.24 50.04,66.29 44.45,71.88 40.64,71.88 40.13,72.39 v40.13,74.93 R16.2 | U1.29 83.09,89.44 v81.79,88.14
  Bottom 0.203: v40.13,74.93 41.15,73.91 74.93,73.91 81.03,80.01 81.03,87.38 v81.79,88.14
BR_7  (via drill 0.4)
  Top 0.203: 22.35,34.8 33.02,34.8 | 33.02,34.8 33.61,35.39 33.61,36.83 D24.3 | D22.3 11.26,35.73 12.19,34.8 22.35,34.8 | 22.35,34.8 22.86,35.31 22.86,37.17 D23.3 | 33.02,34.8 45.21,34.8 45.47,35.05 45.47,37 D25.3 48.26,37.34 49.53,38.61 49.53,66.04 44.2,71.37 39.12,71.37 38.61,71.88 v38.61,74.93 R17.2 | U1.28 83.59,89.18 82.8,88.39 82.8,87.88 v83.82,86.87
  Bottom 0.203: v38.61,74.93 40.13,73.41 75.18,73.41 81.53,79.76 81.53,83.06 83.82,85.34 v83.82,86.87
BR_8  (via drill 0.4)
  Top 0.203: D18.3 D19.3 D20.3 34.12,43.14 35.94,44.96 48.01,44.96 49.02,43.94 | D21.3 48.01,42.42 49.02,43.43 49.02,43.94 | 49.02,43.94 49.02,65.79 43.94,70.87 37.59,70.87 37.08,71.37 v37.08,74.93 R18.2 | U1.27 84.09,88.41 v83.84,88.16
  Bottom 0.203: v37.08,74.93 39.12,72.9 75.44,72.9 82.04,79.5 82.04,82.8 84.84,85.6 84.84,87.16 v83.84,88.16
BTLDR_BUTTON  (via drill 0.4 pad 0.6)
  Top 0.203: U1.56 85.09,77.47 v87.38,75.18
  Bottom 0.203: v87.38,75.18 89.92,75.18 91.44,73.66 94.74,73.66 99.06,77.98 99.06,87.63 CONN2.1
D+
  Top 0.203: U1.45 76.89,83.09 R1.2
D+X
  Top 0.203: D17.3 63.06,81.21 61.98,82.3 61.98,85.11 CONN1.D+ 64.75,84.84 64.77,84.84 69.34,80.26 74.93,80.26 75.55,80.88 R1.1
D-
  Top 0.203: U1.44 78.2,83.59 77.47,84.33 R2.1
D-X
  Top 0.203: R2.2 75.95,84.33 76.2,84.07 76.2,80.26 75.69,79.76 67.07,79.76 D17.2 63.23,83.6 CONN1.D-
DEC_DI_A0  (via drill 0.4)
  Top 0.203: U4.1 21.78,78.17 v22.86,79.25 | U1.39 76.21,86.09 73.66,88.65 71.63,88.65 71.37,88.9 71.37,90.68 69.85,92.2 65.79,92.2 64.77,93.22 v61.21,93.22 | v49.28,83.31 v55.12,83.31
  Bottom 0.203: v22.86,79.25 25.4,81.79 47.75,81.79 v49.28,83.31 | v61.21,93.22 60.71,93.22 58.17,90.68 58.17,86.36 v55.12,83.31
DEC_DI_A1  (via drill 0.4)
  Top 0.203: U4.2 23.75,76.58 24.13,76.96 v24.13,79.25 | U1.40 75.95,85.59 73.41,88.14 71.12,88.14 70.87,88.39 70.87,90.42 69.6,91.69 65.53,91.69 65.28,91.95 v61.21,91.95 | v49.28,82.04 v55.12,82.04
  Bottom 0.203: v24.13,79.25 26.16,81.28 48.51,81.28 v49.28,82.04 | v61.21,91.95 60.45,91.95 58.67,90.17 58.67,85.6 v55.12,82.04
DEC_DI_A2  (via drill 0.4)
  Top 0.203: v25.4,79.25 25.4,77.47 23.24,75.31 U4.3 | U1.41 75.69,85.09 73.15,87.63 70.87,87.63 70.36,88.14 70.36,90.17 69.34,91.19 65.53,91.19 65.02,90.68 v61.21,90.68 | v49.28,80.77 v55.12,80.77
  Bottom 0.203: v25.4,79.25 26.92,80.77 v49.28,80.77 | v61.21,90.68 60.45,90.68 59.18,89.41 59.18,84.84 v55.12,80.77
DEC_DO_A0  (via drill 0.4)
  Top 0.203: U1.16 91.38,89.09 91.69,89.41 91.69,90.68 v91.95,90.93 | U7.1 71.25,3.68 71.63,4.06 71.63,5.59 72.9,6.86 v72.9,9.4 | v34.8,97.54 34.8,96.01 37.85,92.96 44.2,92.96 44.7,92.46 44.7,77.22 51.56,70.36 56.64,70.36 v58.17,68.83
  Bottom 0.203: v91.95,90.93 91.95,91.19 91.69,91.44 91.69,97.28 90.93,98.04 35.31,98.04 v34.8,97.54 | v72.9,9.4 72.9,13.72 70.61,16 60.96,16 58.17,18.8 v58.17,68.83
DEC_DO_A1  (via drill 0.4)
  Top 0.203: U1.15 91.9,88.59 92.2,88.9 92.2,89.41 93.22,90.42 v93.22,90.93 | U7.2 69.72,4.95 71.63,6.86 v71.63,9.4 | v56.9,68.83 55.88,69.85 51.31,69.85 44.2,76.96 44.2,91.95 43.69,92.46 37.59,92.46 33.27,96.77 v33.27,97.54
  Bottom 0.203: v33.27,97.54 34.29,98.55 91.44,98.55 92.2,97.79 92.2,91.95 v93.22,90.93 | v71.63,9.4 72.39,10.16 72.39,13.46 70.36,15.49 60.71,15.49 57.66,18.54 57.66,68.07 v56.9,68.83
DEC_DO_A2  (via drill 0.4)
  Top 0.203: U1.14 92.16,88.09 92.71,88.65 92.71,89.15 v94.49,90.93 | U7.3 69.47,6.22 70.1,6.86 v70.1,9.4 | v55.63,68.83 55.37,69.09 51.31,69.09 43.69,76.71 43.69,91.44 43.18,91.95 37.34,91.95 v31.75,97.54
  Bottom 0.203: v31.75,97.54 33.27,99.06 91.69,99.06 92.71,98.04 92.71,92.71 v94.49,90.93 | v70.1,9.4 71.88,11.18 71.88,13.21 70.1,14.99 60.45,14.99 57.15,18.29 57.15,67.31 v55.63,68.83
DEC_LM_Y0
  Top 0.203: U8.1 60.45,2.03 61.72,3.3 61.72,4.32 62.23,4.83 63.31,4.83 U7.15
DEC_LM_Y1
  Top 0.203: U8.2 60.2,3.3 61.21,4.32 61.21,5.33 61.98,6.1 63.31,6.1 U7.14
DEC_LM_Y2
  Top 0.203: U8.3 60.2,4.57 60.71,5.08 60.71,5.59 61.21,6.1 61.21,6.6 62.1,7.49 U7.13 63.31,7.62
DEC_LM_Y3
  Top 0.203: U8.4 60.2,5.84 60.45,6.1 60.45,6.86 61.98,8.38 62.99,8.38 63.25,8.64 63.31,8.64 U7.12
DEC_LM_Y4
  Top 0.203: U8.5 59.94,7.11 61.47,8.64 61.47,9.14 62.23,9.91 63.31,9.91 U7.11
DEC_LM_Y5
  Top 0.203: U8.6 59.94,8.38 61.47,9.91 61.47,11.18 61.72,11.43 63.31,11.43 U7.10
DEC_LM_Y6
  Top 0.203: U8.7 60.2,9.65 60.96,10.41 60.96,11.94 61.47,12.45 63.31,12.45 U7.9
DEC_LM_Y7
  Top 0.203: U8.8 60.2,10.92 60.45,11.18 60.45,12.7 61.21,13.46 64.77,13.46 67.06,11.18 68.51,11.18 U7.7
GND  (via drill 0.4 pad 0.6, 3.2 pad 6)
  Top 0.203: U1.63 88.59,78.79 v88.9,78.49 | U1.12 91.72,87.09 92.33,86.49 94.61,86.49 94.88,86.76 C8.2 | U1.18 88.59,89.71 88.9,89.41 | 88.9,89.41 89.98,88.33 | v89.41,89.41 88.9,89.41 | VR1.2 48.4,24.89 C12.2 | U5.15 77.17,47.62 77.72,47.08
  Top 0.254: U6.15 77.85,24 78.23,23.62 78.23,20.57 77.98,20.32 v77.47,20.32 | C24.2 95.62,83.95
  Top 0.305: C23.2 96.92,80.37 96.38,80.91 Y1.2 | C8.2 95.12,87.25 95.5,86.87 97.79,86.87 v98.04,86.61 | C24.2 95.62,84.05 Y1.4
  Top 1.27: VR2.4 73.91,90.17 v75.18,88.9
  other vias: 15.49,70.36 20.83,86.36 41.66,96.77 54.86,57.15 56.39,7.62 58.42,80.01 51.94,20.32 20.32,81.53 30.23,87.38 8,74.42 73.15,29.97 98.55,19.43 65.79,10.16 2.54,71.37 54.36,22.1 10.67,1.52 77.72,62.48 54.61,10.41 1.27,92.46 18.29,96.77 13.72,75.95 19.3,70.36 6.35,68.07 10.67,5.08 16.51,5.08 22.35,5.08 28.19,5.08 34.04,5.08 3.56,96.27 96.27,96.27 96.27,3.56 3.56,3.56 90.42,91.19 67.31,97.28 68.33,86.36 76.96,80.01 76.45,39.37 77.98,43.94 67.56,41.66 20.07,73.41 92.96,83.69 84.58,92.46 54.86,45.72 54.86,34.04 97.79,8.38 91.44,1.78 50.29,78.49 45.97,78.49 84.84,71.63 96.77,74.42 94.74,71.63 93.98,78.49 68.58,75.69 67.82,78.99 65.28,65.79 69.34,63.5 66.29,61.72 79.76,89.92 65.28,21.34 54.61,96.01 56.64,93.98 56.64,92.2 66.29,7.11 70.61,11.94 56.9,16 49.02,16 83.06,2.29 29.21,76.2 31.75,69.09 29.72,78.99 98.3,37.34 99.06,90.42 74.68,26.92 74.68,25.4 74.68,23.88 87.88,30.99 87.88,25.91 98.55,24.64 87.88,20.83 71.63,40.89 66.04,38.35 87.88,23.37 87.88,28.45 76.2,20.32 97.28,41.91 87.88,48.26 87.88,58.42 98.04,58.42 98.04,50.8 17.53,83.06 79.5,95.76
  pour Bottom (isolate 0.305): 0,99.82 99.82,99.82 99.82,0 0,0
  pour Top (isolate 0.305): 0,99.82 99.82,99.82 99.82,0 0,0
IH1_2
  Top 0.203: IH1.2 8.74,65.53 D1.1
IH1_4
  Top 0.203: IH1.4 6.2,62.99 D5.1
IH1_6
  Top 0.203: IH1.6 6.84,60.45 D5.2
IH1_8
  Top 0.203: IH1.8 7.37,57.91 8.13,57.15 9.91,57.15 10.16,57.4 10.16,62.21 D1.2
IH1_10
  Top 0.203: IH1.10 8.74,55.37 D9.1
IH1_12
  Top 0.203: IH1.12 6.2,52.83 D13.1
IH1_14
  Top 0.203: IH1.14 6.84,50.29 D13.2
IH1_16
  Top 0.203: IH1.16 7.37,47.75 8.13,46.99 9.91,46.99 10.16,47.24 10.16,52.05 D9.2
IH2_2
  Top 0.203: IH2.2 20.17,65.53 D2.1
IH2_4
  Top 0.203: 20.32,60.3 D6.1 17.63,62.99 IH2.4
IH2_6
  Top 0.203: 20.32,58.06 D6.2 20.42,58.17 19.3,58.17 IH2.6
IH2_8
  Top 0.203: IH2.8 17.78,57.91 18.54,57.15 21.34,57.15 21.59,57.4 21.59,62.21 D2.2
IH2_10
  Top 0.203: IH2.10 20.17,55.37 D10.1
IH2_12
  Top 0.203: IH2.12 17.63,52.83 D14.1
IH2_14
  Top 0.203: 20.32,47.9 D14.2 18.27,50.29 IH2.14
IH2_16
  Top 0.203: IH2.16 18.03,46.74 21.34,46.74 21.59,46.99 21.59,52.05 D10.2
IH3_2
  Top 0.203: D3.1 28.77,65.21 IH3.2
IH3_4
  Top 0.203: IH3.4 29.06,62.99 D7.1
IH3_6
  Top 0.203: IH3.6 29.7,60.45 D7.2
IH3_8
  Top 0.203: IH3.8 29.21,57.15 32.77,57.15 33.02,57.4 33.02,62.21 D3.2
IH3_10
  Top 0.203: IH3.10 31.6,55.37 D11.1
IH3_12
  Top 0.203: IH3.12 29.06,52.83 D15.1
IH3_14
  Top 0.203: IH3.14 28.7,50.29 30.99,48.01 31.85,48.01 D15.2
IH3_16
  Top 0.203: IH3.16 29.46,46.74 32.77,46.74 33.02,46.99 33.02,52.05 D11.2
IH4_2
  Top 0.203: IH4.2 43.28,65.53 D4.1
IH4_4
  Top 0.203: IH4.4 40.74,62.99 D8.1
IH4_6
  Top 0.203: IH4.6 40.13,60.45 42.42,58.17 43.54,58.17 D8.2
IH4_8
  Top 0.203: IH4.8 40.64,57.15 44.45,57.15 44.7,57.4 44.7,62.21 D4.2
IH4_10
  Top 0.203: IH4.10 43.28,55.37 D12.1
IH4_12
  Top 0.203: IH4.12 40.74,52.83 D16.1
IH4_14
  Top 0.203: IH4.14 41.38,50.29 D16.2
IH4_16
  Top 0.203: IH4.16 41.66,47.75 42.42,46.99 44.45,46.99 44.7,47.24 44.7,52.05 D12.2
IH5_2
  Top 0.203: IH5.2 8.74,43.69 D18.1
IH5_4
  Top 0.203: IH5.4 6.2,41.15 D22.1
IH5_6
  Top 0.203: D22.2 8.32,36.39 7.37,37.34 6.86,37.34 IH5.6
IH5_8
  Top 0.203: IH5.8 6.6,35.05 9.91,35.05 10.16,35.31 10.16,40.37 D18.2
IH5_10
  Top 0.203: IH5.10 8.74,33.53 D26.1
IH5_12
  Top 0.203: IH5.12 6.2,30.99 D30.1
IH5_14
  Top 0.203: IH5.14 7.87,26.16 8.99,26.16 D30.2
IH5_16
  Top 0.203: IH5.16 6.35,25.15 9.91,25.15 10.16,25.4 10.16,30.21 D26.2
IH6_2
  Top 0.203: IH6.2 20.17,43.69 D19.1
IH6_4
  Top 0.203: IH6.4 17.63,41.15 D23.1
IH6_6
  Top 0.203: IH6.6 17.27,38.61 19.56,36.32 20.42,36.32 D23.2
IH6_8
  Top 0.203: IH6.8 17.78,35.31 21.34,35.31 21.59,35.56 21.59,40.37 D19.2
IH6_10
  Top 0.203: IH6.10 20.17,33.53 D27.1
IH6_12
  Top 0.203: IH6.12 17.63,30.99 D31.1
IH6_14
  Top 0.203: IH6.14 19.3,26.16 20.42,26.16 D31.2
IH6_16
  Top 0.203: IH6.16 17.78,25.15 21.34,25.15 21.59,25.4 21.59,30.21 D27.2
IH7_2
  Top 0.203: IH7.2 31.6,43.69 D20.1
IH7_4
  Top 0.203: IH7.4 29.06,41.15 D24.1
IH7_6
  Top 0.203: IH7.6 28.7,38.61 30.99,36.32 31.85,36.32 D24.2
IH7_8
  Top 0.203: IH7.8 29.21,35.31 32.77,35.31 33.02,35.56 33.02,39.12 32.26,39.88 32.26,41.3 32.09,41.47 D20.2
IH7_10
  Top 0.203: IH7.10 31.6,33.53 D28.1
IH7_12
  Top 0.203: IH7.12 29.06,30.99 D32.1
IH7_14
  Top 0.203: IH7.14 28.45,28.19 30.48,26.16 31.85,26.16 D32.2
IH7_16
  Top 0.203: IH7.16 28.7,25.91 29.46,25.15 32.77,25.15 33.02,25.4 33.02,28.7 32,29.72 32,31.22 D28.2
IH8_2
  Top 0.203: IH8.2 43.28,43.69 D21.1
IH8_4
  Top 0.203: D25.1 43.88,38.29 44.7,39.12 44.7,42.16 44.45,42.42 41.15,42.42 IH8.4
IH8_6
  Top 0.203: D25.2 42.1,36.39 IH8.6
IH8_8
  Top 0.203: IH8.8 38.61,37.34 38.61,39.62 38.86,39.88 42.01,39.88 D21.2
IH8_10
  Top 0.203: IH8.10 43.28,33.53 D29.1
IH8_12
  Top 0.203: IH8.12 41.91,30.99 42.67,30.23 42.67,29.06 D33.1
IH8_14
  Top 0.203: D33.2 42.35,26.23 41.66,26.92 41.4,26.92 IH8.14
IH8_16
  Top 0.203: IH8.16 40.64,25.15 44.45,25.15 44.7,25.4 44.7,27.94 45.72,28.96 45.72,30.48 44.96,31.24 43.67,31.24 D29.2
LC_1
  Top 0.203: OH1.2 OH1.4 OH1.6 OH1.8 OH1.10 OH1.12 12.45,2.03 U8.18
LC_2
  Top 0.203: OH2.2 OH2.4 OH2.6 OH2.8 OH2.10 OH2.12 17.78,2.54 48.26,2.54 49.02,3.3 U8.17
LC_3
  Top 0.203: OH3.2 OH3.4 OH3.6 OH3.8 OH3.10 OH3.12 23.11,3.05 47.5,3.05 49.02,4.57 U8.16
LC_4
  Top 0.203: OH4.2 OH4.4 OH4.6 OH4.8 OH4.10 OH4.12 28.45,3.56 47.24,3.56 49.53,5.84 U8.15
LC_5
  Top 0.203: OH5.2 OH5.4 OH5.6 OH5.8 OH5.10 OH5.12 33.78,4.06 46.48,4.06 49.53,7.11 U8.14
LC_6
  Top 0.203: OH6.10 OH6.12 39.12,4.57 45.47,4.57 49.28,8.38 U8.13 | OH6.10 OH6.8 OH6.6 OH6.4 OH6.2 | OH6.10 34.8,10.92
LC_7
  Top 0.203: OH7.2 OH7.4 OH7.6 OH7.8 OH7.10 41.91,10.16 47.24,10.16 47.75,9.65 U8.12
  Bottom 0.203: OH7.12 OH7.10
LC_8
  Top 0.203: OH8.2 OH8.4 OH8.6 OH8.8 OH8.10 46.99,10.92 U8.11
  Bottom 0.203: OH8.12 OH8.10
LEDS_VCC
  Top 0.203: VR1.5 52.9,25.84
  Top 0.305: Q3.2 91.44,13.72 91.69,13.97 91.69,15.49 | Q1.2 Q1.5 83.69,13.72 83.95,13.97 83.95,14.86 84.58,15.49 86.61,15.49 86.87,15.24 86.87,13.72 | 52.9,25.84 53.34,25.4 53.34,18.03 54.36,17.02 88.14,17.02 89.66,15.49 | 91.69,15.49 94.36,15.49 94.61,15.24 94.61,13.72 | 89.66,15.49 89.03,14.86 89.03,14.1 88.65,13.72 Q2.5 86.87,13.72 | 89.66,15.49 91.69,15.49 | R19.1 R21.1 R27.1 R29.1 R23.1 R25.1 91.3,6.46 94.61,9.78 94.61,13.72 | VR1.5 53.8,25.84 C13.1 | Q2.2 86.87,13.72 | Q3.5 94.61,13.72
LR_1_MI  (via drill 0.4)
  Top 0.203: R19.2 79.5,8.13 80.26,8.89 80.26,11.18 v79.76,11.68 79.25,12.19 79.25,14.48 79.44,14.67 Q1.1 | U1.62 88.09,80.47 88.6,80.47 88.9,80.77 v88.9,82.04
  Bottom 0.203: v79.76,11.68 82.8,8.64 93.98,8.64 97.79,12.45 97.79,17.02 95.76,19.05 63.75,19.05 62.74,20.07 62.74,66.04 64.52,67.82 78.23,67.82 87.88,77.47 87.88,80.26 88.14,80.52 88.65,80.52 88.9,80.77 v88.9,82.04
LR_1_MO  (via drill 0.4 pad 0.6)
  Top 0.203: v76.2,9.02 79.12,9.02 79.63,9.53 79.63,10.54 78.63,11.54 R20.1
  Bottom 0.203: OH8.1 42.67,22.86 | OH7.1 36.83,22.86 | 42.67,22.86 36.83,22.86 | OH6.1 30.99,22.86 | 36.83,22.86 30.99,22.86 | OH5.1 25.15,22.86 | 30.99,22.86 25.15,22.86 | OH4.1 19.3,22.86 | 25.15,22.86 19.3,22.86 | OH3.1 13.46,22.86 | 19.3,22.86 13.46,22.86 | 7.62,22.86 OH2.1 | 13.46,22.86 7.62,22.86 | OH1.1 4.32,22.86 7.62,22.86 | 42.67,22.86 47.24,22.86 56.64,13.46 64.77,13.46 69.6,8.64 75.82,8.64 v76.2,9.02
LR_1_MO_R
  Top 0.203: R20.2 77.47,14.35 78.87,15.75 82.68,15.75 83.09,15.34 Q1.6
LR_2_MI  (via drill 0.4)
  Top 0.203: R21.2 v81.03,11.68 81.03,12.23 Q1.3 | U1.61 87.59,80.99 v87.88,81.28
  Bottom 0.203: v81.03,11.68 83.57,9.14 93.73,9.14 97.28,12.7 97.28,16.76 95.5,18.54 63.5,18.54 62.23,19.81 62.23,66.29 64.26,68.33 77.98,68.33 87.38,77.72 87.38,80.77 v87.88,81.28
LR_2_MO  (via drill 0.4 pad 0.6)
  Top 0.203: v53.59,15.24 75.31,15.24 75.95,14.61 R22.2
  Bottom 0.203: OH8.3 42.67,20.32 | OH7.3 36.83,20.32 | 42.67,20.32 36.83,20.32 | OH6.3 30.99,20.32 | 36.83,20.32 30.99,20.32 | OH5.3 25.15,20.32 | 30.99,20.32 25.15,20.32 | OH4.3 19.3,20.32 | 25.15,20.32 19.3,20.32 | OH3.3 13.46,20.32 | 19.3,20.32 13.46,20.32 | 7.62,20.32 OH2.3 | 13.46,20.32 7.62,20.32 | OH1.3 4.32,20.32 7.62,20.32 | v53.59,15.24 48.51,20.32 42.67,20.32
LR_2_MO_R  (via drill 0.4, 0.4 pad 0.6)
  Top 0.203: v78.61,9.91 77.6,9.91 76.96,10.54 76.95,10.54 R22.1 | Q1.4 81.85,12.77 v81.79,12.7
  Bottom 0.203: v78.61,9.91 78.61,12.83 78.99,13.21 81.28,13.21 v81.79,12.7
LR_3_MI  (via drill 0.4)
  Top 0.203: Q2.1 85.28,14.67 84.33,13.72 v84.33,11.68 84.33,9.54 R27.2 | U1.17 89.12,90.97 90.17,89.92 v90.93,89.92
  Bottom 0.203: v84.33,11.68 86.36,9.65 93.47,9.65 96.77,12.95 96.77,16.51 95.25,18.03 63.25,18.03 61.72,19.56 61.72,66.55 64.01,68.83 77.72,68.83 86.87,77.98 86.87,81.53 88.39,83.06 89.92,83.06 90.93,84.07 v90.93,89.92
LR_3_MO  (via drill 0.4)
  Top 0.203: R28.1 74.42,10.67 74.68,10.41 v75.44,10.41
  Bottom 0.203: OH8.9 42.67,12.7 | OH7.9 36.83,12.7 | 42.67,12.7 36.83,12.7 | OH6.9 30.99,12.7 | 36.83,12.7 30.99,12.7 | OH5.9 25.15,12.7 | 30.99,12.7 25.15,12.7 | OH4.9 19.3,12.7 | 25.15,12.7 19.3,12.7 | OH3.9 13.46,12.7 | 19.3,12.7 13.46,12.7 | 7.62,12.7 OH2.9 | 13.46,12.7 7.62,12.7 | OH1.9 4.32,12.7 7.62,12.7 | 42.67,12.7 47.75,12.7 48.26,12.19 48.26,6.86 53.09,2.03 72.9,2.03 73.41,2.54 73.41,6.1 74.42,7.11 76.71,7.11 77.22,7.62 77.22,9.4 76.2,10.41 v75.44,10.41
LR_3_MO_R
  Top 0.203: Q2.6 88.17,15.46 87.25,16.38 78.36,16.38 76.71,14.73 76.71,12.19 75.07,12.19 R28.2
LR_4_MI  (via drill 0.4)
  Top 0.203: Q2.3 85.6,12.74 v85.6,11.68 85.6,10.16 84.07,8.64 R29.2 | U1.22 86.59,91.93 v87.12,92.46
  Bottom 0.203: v85.6,11.68 87.12,10.16 93.22,10.16 96.27,13.21 96.27,16.26 95,17.53 62.99,17.53 61.21,19.3 61.21,66.8 63.75,69.34 77.47,69.34 86.36,78.23 86.36,81.79 88.39,83.82 89.66,83.82 90.42,84.58 90.42,87.12 88.14,89.41 87.12,89.41 86.61,89.92 86.61,91.95 v87.12,92.46
LR_4_MO  (via drill 0.4)
  Top 0.203: v78.23,2.29 78.49,2.54 78.49,7.37 78.09,7.76 R30.1
  Bottom 0.203: OH6.11 30.99,10.16 | 30.99,10.16 36.83,10.16 OH7.11 43.18,3.81 43.94,3.81 | OH5.11 25.15,10.16 | 30.99,10.16 25.15,10.16 | OH4.11 19.3,10.16 | 25.15,10.16 19.3,10.16 | OH3.11 13.46,10.16 | 19.3,10.16 13.46,10.16 | 7.62,10.16 OH2.11 | 13.46,10.16 7.62,10.16 | OH1.11 4.32,10.16 7.62,10.16 | OH8.11 43.94,3.81 | 43.94,3.81 45.72,3.81 48.51,1.02 76.96,1.02 v78.23,2.29
LR_4_MO_R  (via drill 0.4, 0.4 pad 0.6)
  Top 0.203: v90.93,7.62 93.5,10.19 Q3.4 | v74.42,4.83 R26.2
  Bottom 0.203: v90.93,7.62 86.74,3.43 75.82,3.43 v74.42,4.83
LR_5_MI  (via drill 0.4)
  Top 0.203: R23.2 85.6,7.87 v89.41,11.68 89.66,11.94 89.66,14.22 90.1,14.67 Q3.1 | U1.23 86.09,92.21 v85.85,92.46
  Bottom 0.203: v89.41,11.68 90.42,10.67 92.96,10.67 95.76,13.46 95.76,16 94.74,17.02 62.74,17.02 60.71,19.05 60.71,67.06 63.5,69.85 77.22,69.85 85.85,78.49 85.85,82.04 88.14,84.33 89.41,84.33 89.92,84.84 89.92,86.87 87.88,88.9 86.61,88.9 86.11,89.41 86.11,92.2 v85.85,92.46
LR_5_MO  (via drill 0.4 pad 0.6)
  Top 0.203: R24.1 73.42,10.29 73.42,13.57 73.03,13.97 v53.59,13.97
  Bottom 0.203: OH8.5 42.67,17.78 | OH7.5 36.83,17.78 | 42.67,17.78 36.83,17.78 | OH6.5 30.99,17.78 | 36.83,17.78 30.99,17.78 | OH5.5 25.15,17.78 | 30.99,17.78 25.15,17.78 | OH4.5 19.3,17.78 | 25.15,17.78 19.3,17.78 | OH3.5 13.46,17.78 | 19.3,17.78 13.46,17.78 | 7.62,17.78 OH2.5 | 13.46,17.78 7.62,17.78 | OH1.5 4.32,17.78 7.62,17.78 | v53.59,13.97 49.78,17.78 42.67,17.78
LR_5_MO_R  (via drill 0.4)
  Top 0.203: R24.2 v75.95,4.83 | Q3.6 92.64,14.67 92.46,14.48 92.46,10.41 v89.66,7.62
  Bottom 0.203: v89.66,7.62 85.98,3.94 76.83,3.94 v75.95,4.83
LR_6_MI  (via drill 0.4)
  Top 0.203: R25.2 87.12,8.13 v90.68,11.68 90.68,12.54 Q3.3 | v88.9,85.34 85.34,85.34 84.84,85.85 84.84,89.15 84.58,89.41 84.59,89.42 U1.26
  Bottom 0.203: v90.68,11.68 91.19,11.18 92.71,11.18 95.25,13.72 95.25,15.75 94.49,16.51 62.48,16.51 60.2,18.8 60.2,67.31 63.25,70.36 76.96,70.36 85.34,78.74 85.34,82.3 88.39,85.34 v88.9,85.34
LR_6_MO  (via drill 0.4 pad 0.6)
  Top 0.203: v72.39,3.3 72.39,5.73 R26.1
  Bottom 0.203: OH8.7 42.67,15.24 | OH7.7 36.83,15.24 | 42.67,15.24 36.83,15.24 | OH6.7 30.99,15.24 | 36.83,15.24 30.99,15.24 | OH5.7 25.15,15.24 | 30.99,15.24 25.15,15.24 | OH4.7 19.3,15.24 | 25.15,15.24 19.3,15.24 | OH3.7 13.46,15.24 | 19.3,15.24 13.46,15.24 | 7.62,15.24 OH2.7 | 13.46,15.24 7.62,15.24 | OH1.7 4.32,15.24 7.62,15.24 | 42.67,15.24 46.99,15.24 49.02,13.21 49.02,7.87 53.85,3.05 72.14,3.05 v72.39,3.3
LR_6_MO_R  (via drill 0.4)
  Top 0.203: Q2.4 88.17,11.71 84.84,8.38 84.84,7.11 87.88,7.11 v88.39,7.62 | R30.2 v77.47,4.83
  Bottom 0.203: v88.39,7.62 85.34,4.57 77.72,4.57 v77.47,4.83
MIDI_IN  (via drill 0.4)
  Top 0.203: R4.2 6.48,72.26 6.86,71.88 16.26,71.88 U2.6 | v58.67,93.98 64.77,93.98 66.04,92.71 75.44,92.71 76.2,91.95 76.2,87.63 77.24,86.59 U1.38
  Bottom 0.203: v58.67,93.98 55.63,97.03 51.31,97.03 48.51,94.23 33.02,94.23 28.19,89.41 28.19,85.34 24.13,81.28 21.34,81.28 19.3,79.25 19.3,74.93 U2.6
MIDI_IN_4
  Top 0.203: CONN3.4 4.52,84.02 R5.1
MIDI_IN_5  (via drill 0.4 pad 0.6)
  Top 0.203: U2.3 11.43,73.15 12.19,73.91 12.19,79.25 v12.95,80.01 12.83,79.88 D34.3
  Bottom 0.203: CONN3.5 16.97,84.03 v12.95,80.01
MIDI_IN_DIODE_OUT  (via drill 0.4 pad 0.6)
  Top 0.203: D34.2 6.67,78.93 U2.2 | v3.05,79.25 3.05,82.66 R5.2
  Bottom 0.203: U2.2 6.6,75.69 v3.05,79.25
MIDI_IN_LED  (via drill 0.4 pad 0.6)
  Top 0.203: U1.43 81.3,84.09 v81.79,84.58 | R7.2 81.52,96.53 v82.55,95.5
  Bottom 0.203: v81.79,84.58 83.06,85.85 83.06,95.25 82.8,95.5 v82.55,95.5
MIDI_IN_LED_R
  Top 0.203: R7.1 83.44,96.65 83.57,96.52 83.57,94.74 83.82,94.49 85.6,94.49 86.11,95 86.11,96.68 D36.A
MIDI_OUT  (via drill 0.4)
  Top 0.203: v58.67,95.25 64.26,95.25 66.42,93.09 75.69,93.09 76.58,92.2 76.58,88.27 77.75,87.09 U1.37 | R12.2 3.81,88.14 v4.83,89.15
  Bottom 0.203: v58.67,95.25 56.39,97.54 51.05,97.54 48.26,94.74 32.77,94.74 27.94,89.92 5.59,89.92 v4.83,89.15
MIDI_OUT_4
  Top 0.203: R10.1 33.42,90.03 36.52,86.93 CONN4.4
MIDI_OUT_5  (via drill 0.4)
  Top 0.203: v31.75,83.06 26.67,83.06 25.91,82.3 22.1,82.3 19.56,84.84 17.27,84.84 13.72,88.39 5.48,88.39 R12.1
  Bottom 0.203: CONN4.5 44.79,82.3 32.51,82.3 v31.75,83.06
MIDI_OUT_LED  (via drill 0.4 pad 0.6)
  Top 0.203: v81.79,86.36 81.79,85.85 80.53,84.59 U1.42 | R6.2 81.52,95.27 v81.28,95.5
  Bottom 0.203: v81.79,86.36 82.55,87.12 82.55,94.23 v81.28,95.5
MIDI_OUT_LED_R
  Top 0.203: R6.1 82.82,94.47 83.31,93.98 88.39,93.98 89.41,95 89.41,96.93 D35.A
MISO  (via drill 0.4)
  Top 0.203: U1.52 83.09,71.85 v86.36,68.58
  Bottom 0.203: CONN5.2 90.93,70.87 90.93,69.6 89.92,68.58 v86.36,68.58
MOSI
  Top 0.203: U1.57 85.59,77.73 87.38,75.95 91.44,75.95 CONN5.1
MUX_COMMON_1
  Top 0.203: U1.10 90.98,86.11 97.03,86.11 98.81,84.33 98.81,66.04 98.04,65.28 85.85,65.28 85.34,65.79 69.34,65.79 67.82,64.26 67.82,61.21 66.91,60.3 U5.1
MUX_COMMON_2
  Top 0.203: U6.1 66.67,35.43 64.26,37.85 64.26,61.98 68.58,66.29 85.6,66.29 86.11,65.79 97.79,65.79 98.3,66.29 98.3,84.07 96.77,85.6 U1.9
MUX_S0  (via drill 0.4)
  Top 0.203: U5.10 69.22,47.62 69.85,46.99 v69.85,41.15 | v69.09,35.31 68.58,34.8 65.79,34.8 65.28,34.29 65.28,24.38 65.66,24 U6.10 68.71,24 69.09,23.62 69.09,20.57 68.58,20.07 64.01,20.07 63.25,20.83 63.25,75.44 v62.99,75.69 | v51.82,90.68 51.82,96.77 52.32,97.28 64.01,97.28 67.44,93.85 76.2,93.85 77.34,92.71 77.34,89.03 78.28,88.09 U1.35
  Bottom 0.203: v69.85,41.15 69.85,36.07 v69.09,35.31 | v51.82,90.68 51.82,90.42 52.58,89.66 52.58,79.5 55.12,76.96 61.72,76.96 v62.99,75.69
MUX_S1  (via drill 0.4)
  Top 0.203: U5.11 68.45,46.35 v69.09,45.72 | 63.75,35.31 63.75,23.11 64.14,22.73 U6.11 | 63.75,35.31 63.75,74.17 64.52,74.93 v64.52,75.69 | v64.52,35.31 63.75,35.31 | v53.09,90.68 53.09,96.27 53.59,96.77 63.75,96.77 67.06,93.47 75.95,93.47 76.96,92.46 76.96,88.65 78.01,87.59 U1.36
  Bottom 0.203: v69.09,45.72 69.09,39.88 v64.52,35.31 | v64.52,75.69 62.74,77.47 55.37,77.47 53.09,79.76 v53.09,90.68
MUX_S2  (via drill 0.4)
  Top 0.203: U5.14 74.55,46.35 73.91,46.99 73.91,55.12 73.66,55.37 71.88,55.37 71.12,54.61 65.02,54.61 64.77,54.36 64.77,41.66 72.14,34.29 74.17,34.29 74.93,33.53 74.93,31.24 74.42,30.73 74.42,29.21 73.91,28.7 73.91,23.37 v74.68,22.61 74.8,22.73 U6.14 | v73.15,21.59 70.61,19.05 62.74,19.05 62.23,19.56 62.23,73.91 v60.45,75.69 | v49.28,90.68 49.28,97.54 50.04,98.3 64.52,98.3 68.2,94.61 76.96,94.61 78.11,93.47 78.11,89.79 78.8,89.09 U1.33
  Bottom 0.203: v49.28,90.68 51.56,88.39 51.56,78.99 54.61,75.95 60.2,75.95 v60.45,75.69 | v73.15,21.59 73.66,21.59 v74.68,22.61
MUX_S3  (via drill 0.4)
  Top 0.203: U6.13 74.55,21.46 73.41,22.61 73.41,28.96 73.91,29.46 v73.91,32 | U5.13 74.3,45.09 73.41,45.97 73.41,52.07 72.14,53.34 65.53,53.34 65.28,53.09 65.28,41.91 71.88,35.31 v73.91,35.31 | v70.1,21.84 70.1,20.07 69.6,19.56 63.5,19.56 62.74,20.32 62.74,74.68 v61.72,75.69 | v50.55,90.68 50.55,97.28 51.05,97.79 64.26,97.79 67.82,94.23 76.71,94.23 77.72,93.22 77.72,89.41 78.54,88.59 U1.34
  Bottom 0.203: v73.91,35.31 v73.91,32 70.1,28.19 v70.1,21.84 | v50.55,90.68 50.55,90.42 52.07,88.9 52.07,79.25 54.86,76.45 60.96,76.45 v61.72,75.69
N$1
  Top 0.203: U1.31 82.09,92.4 C1.2
N$2
  Top 0.203: U1.47 78.9,82.09 C2.1
NRST
  Top 0.203: U1.7 92.33,84.59 C17.1
OSC_IN
  Top 0.203: U1.5 91.54,83.59 91.82,83.31 91.82,82.17 92.71,81.28 93.86,81.28 Y1.1 95.49,79.65 95.49,79.5 C23.1
OSC_OUT
  Top 0.203: U1.6 91.67,84.09 92.2,83.57 92.2,82.42 92.84,81.79 95.75,81.79 96.28,82.31 Y1.3 96.38,82.66 96.92,83.2 C24.1
PWR_LED_R
  Top 0.203: R8.2 84.42,98.04 D37.A
SCK  (via drill 0.4)
  Top 0.203: U1.51 82.59,71.08 84.84,68.83 84.84,68.58 v86.36,67.06
  Bottom 0.203: CONN5.3 90.93,68.33 90.93,66.29 90.42,65.79 87.63,65.79 v86.36,67.06
SCL
  Top 0.203: U1.58 86.09,78.24 87.88,76.45 93.47,76.45 93.98,75.95 93.98,71.12 95.25,69.85 CONN6.2
SDA
  Top 0.203: U1.59 86.59,78.51 88.14,76.96 93.73,76.96 94.49,76.2 94.49,73.15 95.25,72.39 CONN6.1
SWDCLK
  Top 0.203: U1.49 81.59,70.04 CONN8.2
SWDIO  (via drill 0.4)
  Top 0.203: U1.46 78.02,82.59 v76.96,81.53 | CONN8.1 81.03,69.09 v74.42,75.69
  Bottom 0.203: v74.42,75.69 74.42,78.99 v76.96,81.53
UART_RX
  Top 0.203: U1.54 84.09,76.43 88.14,72.39 CONN7.1
UART_TX
  Top 0.203: U1.53 83.59,74.65 CONN7.2
USB_SHIELD
  Top 1.016: L1.2 54.61,90.42 CONN1.S1 CONN1.S2

## Text on the board
tNames: PWR | IN | OUT | IN | OUT | C1 | R1 | C3 | R1 | C5 | R1 | C7 | R1 | C2 | R2 | C4 | R2 | C6 | R2 | C8 | R2 | 0 | 8 | C1 | R2 | C3 | R2 | C5 | R2 | C7 | R2 | 1 | 9 | C2 | R1 | C4 | R1 | C6 | R1 | C8 | R1 | 2 | 10 | C1 | R3 | C3 | R3 | C5 | R3 | C7 | R3 | 3 | 11 | C2 | R4 | C4 | R4 | C6 | R4 | C8 | R4 | 4 | 12 | C1 | R4 | C3 | R4 | C5 | R4 | C7 | R4 | 5 | 13 | C2 | R3 | C4 | R3 | C6 | R3 | C8 | R3 | 6 | 14 | 7 | 15 | C1 | R5 | C3 | R5 | C5 | R5 | C7 | R5 | G | S | + | G | S | + | C2 | R6 | C4 | R6 | C6 | R6 | C8 | R6 | C1 | R6 | C3 | R6 | C5 | R6 | C7 | R6 | 16 | 24 | 17 | 25 | C2 | R5 | C4 | R5 | C6 | R5 | C8 | R5 | C1 | R7 | C3 | R7 | C5 | R7 | C7 | R7 | 18 | 26 | OpenDeck | C2 | R8 | C4 | R8 | C6 | R8 | C8 | R8 | 19 | 27 | C1 | R8 | C3 | R8 | C5 | R8 | C7 | R8 | 20 | 28 | C2 | R7 | C4 | R7 | C6 | R7 | C8 | R7 | 21 | 29 | 22 | 30 | R1 | 23 | 31 | R2 | R3 | R4 | R5 | R6 | C1 | C2 | C3 | C4 | C5 | C6 | C7 | C8
bNames: https://shanteacontrols.com | BTLDR | OpenDeck board / Revision: 2.0.1 / 09/2020